# Altium schematic sheet 4_EXT_USR_LED.schdoc
size 1145 x 812 mm; Symbol: Altium_A0; Device: Altium_A0
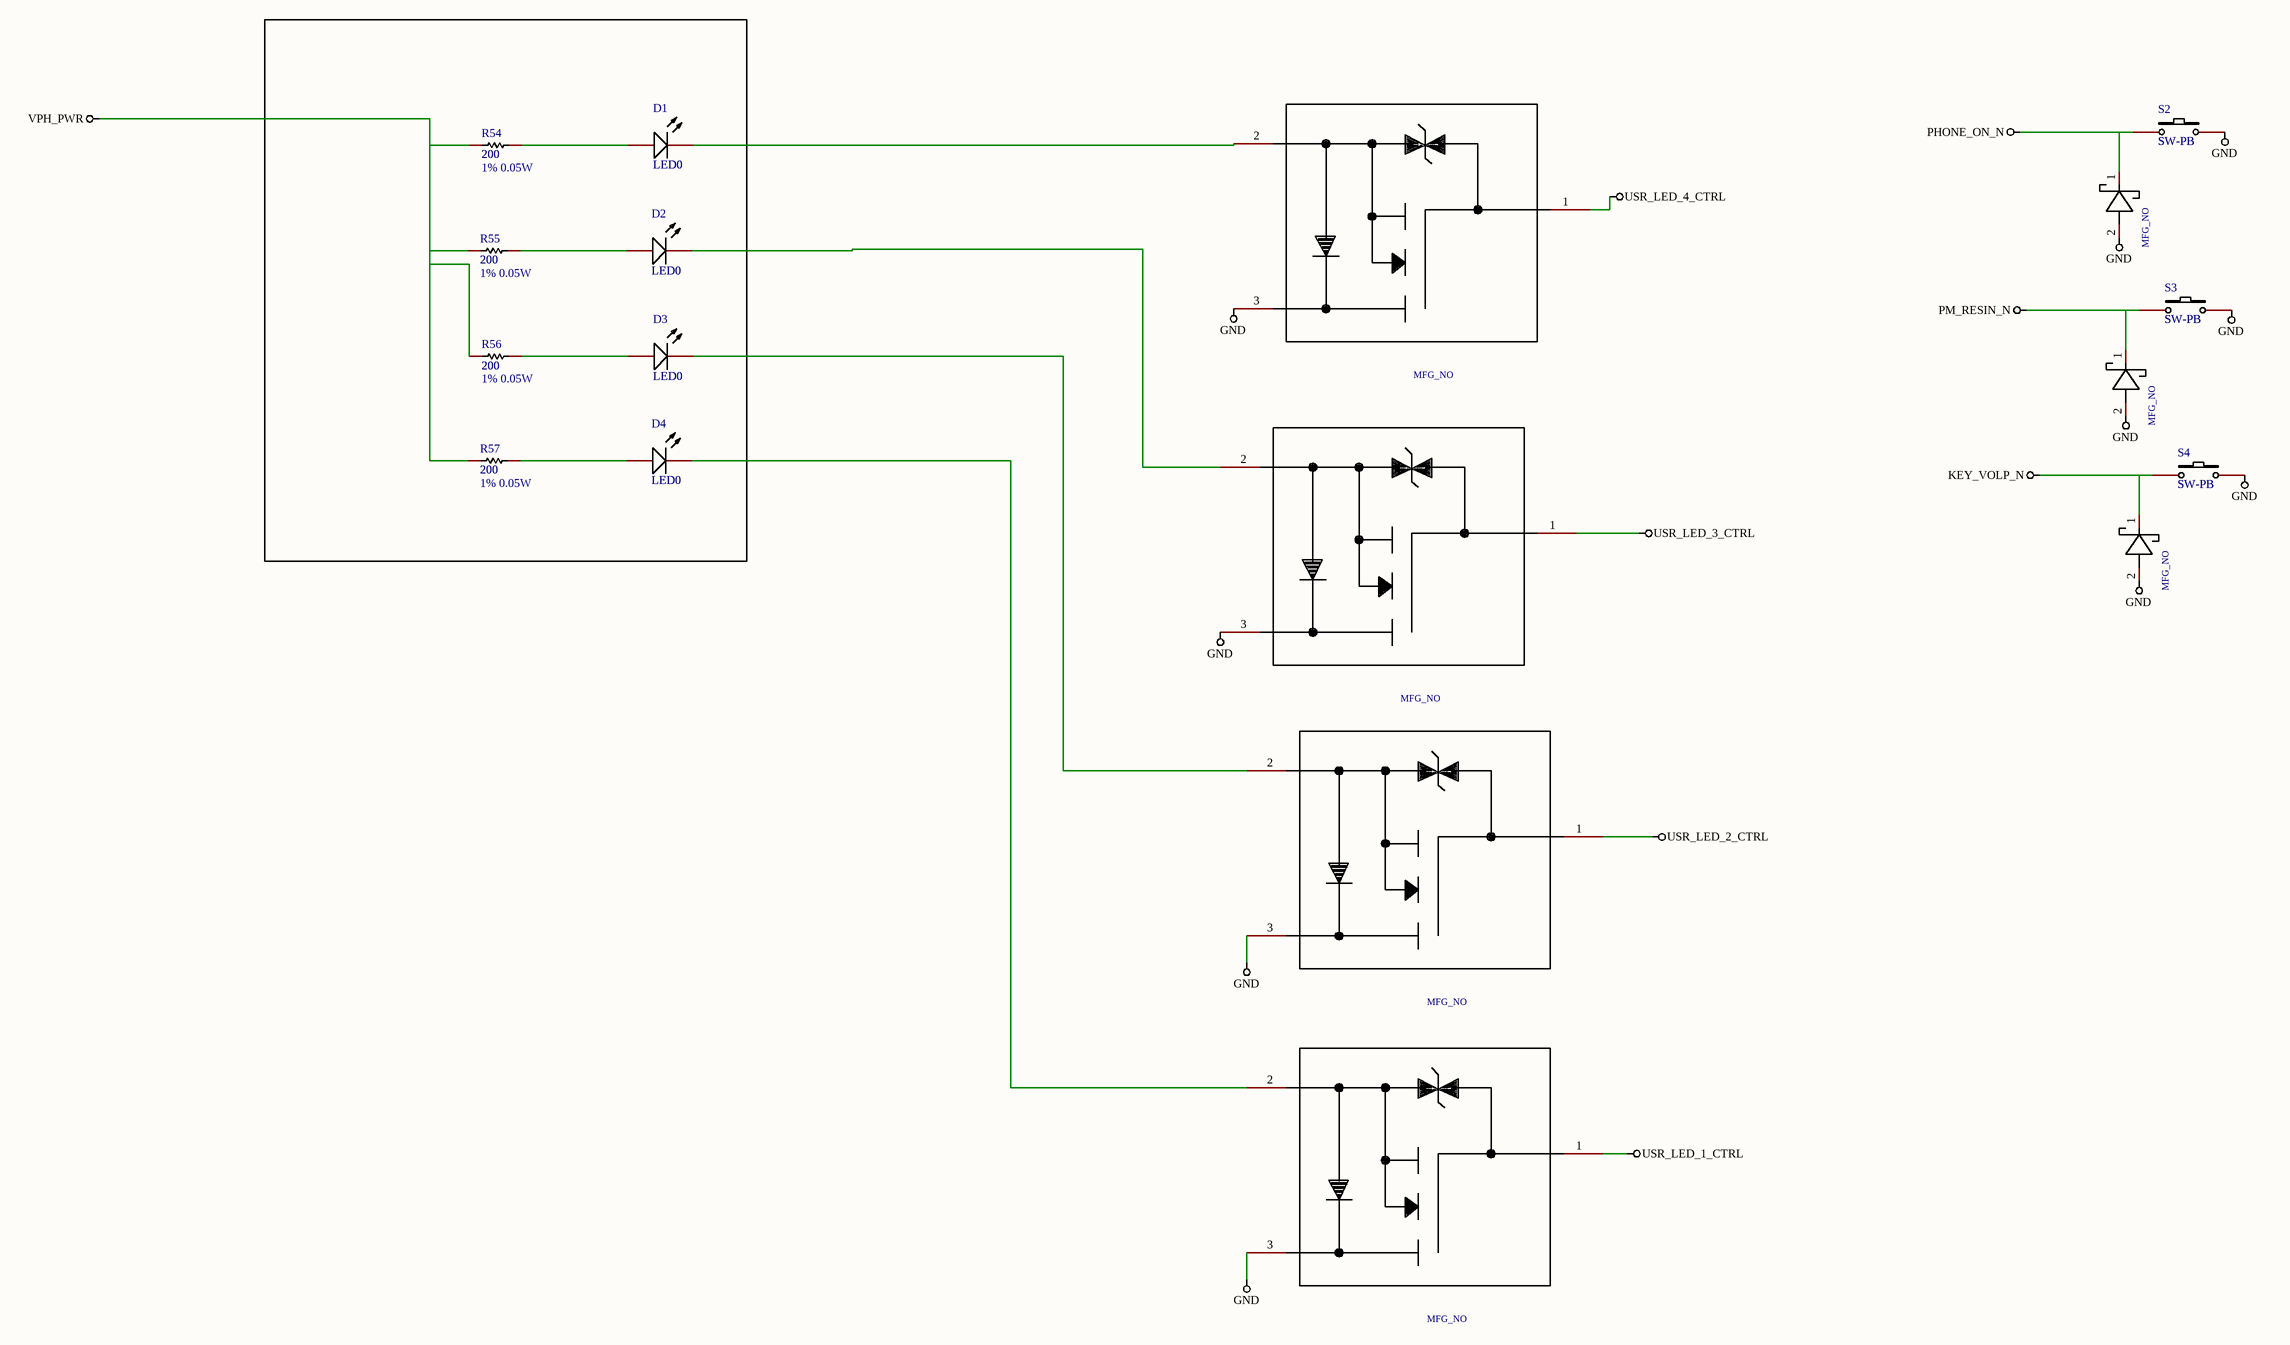
[diagram p0: 4_EXT_USR_LED.schdoc]

## Parts
CR0  PART_ID: MFG_NO  (hidden comment: SCHOTTKY)
CR1  PART_ID: MFG_NO  (hidden comment: SCHOTTKY)
CR2  PART_ID: MFG_NO  (hidden comment: SCHOTTKY)
D1  LED0
D2  LED0
D3  LED0
D4  LED0
Q2  PART_ID: MFG_NO  (hidden comment: nfet_zener_bidir)
Q3  PART_ID: MFG_NO  (hidden comment: nfet_zener_bidir)
Q4  PART_ID: MFG_NO  (hidden comment: nfet_zener_bidir)
Q5  PART_ID: MFG_NO  (hidden comment: nfet_zener_bidir)
R54  200  value 1% 0.05W
R55  200  value 1% 0.05W
R56  200  value 1% 0.05W
R57  200  value 1% 0.05W
S2  SW-PB
S3  SW-PB
S4  SW-PB

## Nets
GND: CR0.2(POS) CR1.2(POS) CR2.2(POS) Q2.3(D) Q3.3(D) Q4.3(D) Q5.3(D) S2.2 S3.2 S4.2
KEY_VOLP_N: CR2.1(NEG) S4.1
PHONE_ON_N: CR0.1(NEG) S2.1
PM_RESIN_N: CR1.1(NEG) S3.1
USR_LED_1_CTRL: Q5.1(G)
USR_LED_2_CTRL: Q4.1(G)
USR_LED_3_CTRL: Q3.1(G)
USR_LED_4_CTRL: Q2.1(G)
VPH_PWR: R54.1 R55.1 R56.1 R57.1
NetD1_1: D1.1(A) R54.2
NetD1_2: D1.2(K) Q2.2(S)
NetD2_1: D2.1(A) R55.2
NetD2_2: D2.2(K) Q3.2(S)
NetD3_1: D3.1(A) R56.2
NetD3_2: D3.2(K) Q4.2(S)
NetD4_1: D4.1(A) R57.2
NetD4_2: D4.2(K) Q5.2(S)

## Notes on the sheet
- 1
- 2
- 3
- 4
- 5
- 6
- A
- B
- C
- D
- Title
- Size
- A0
- Number
- Revision
- File:
- Date:
- Drawn By:
- Sheet
- Of

## Library data of the parts
CR0-CR2 = SCHOTTKY: PART_NUMBER: MCN_NO; OriginalSymbolOrigin: (-100,100); CDS_LMAN_SYM_OUTLINE: -50,75,50,-75; Add into BOM: yes; Name: SCHOTTKY; Symbol: SCHOTTKY; Device: SCHOTTKY; SYMNAME: SCHOTTKY; PACK_TYPE: ?; Convert to PCB: yes; Origin Footprint: SCHOTTKY; Design Item ID: SCHOTTKY; Library Name: MSM8916_DRAM_PMIC_REF_Library
D1-D4 = LED0: Typical INFRARED GaAs LED; Add into BOM: yes; Origin Footprint: LED-0; Name: LED0; Symbol: LED0; Device: LED0; Published: 8-Jun-2000; LatestRevisionDate: 08-Jul-2005; LatestRevisionNote: Mech Layer 1 removed.; PackageReference: LED-0; Publisher: Altium Limited; PackageDescription: LED; 2 Leads; Convert to PCB: yes; Design Item ID: LED0; Library Name: Miscellaneous Devices
Q2-Q5 = nfet_zener_bidir: PART_NUMBER: MCN_NO; OriginalSymbolOrigin: (-525,450); CDS_LMAN_SYM_OUTLINE: -475,450,475,-450; Add into BOM: yes; Name: nfet_zener_bidir; Symbol: NFET_ZENER_BIDIR; Device: nfet_zener_bidir; SYMNAME: nfet_zener_bidir; PACK_TYPE: ?; Convert to PCB: yes; Origin Footprint: NFET_ZENER_BIDIR; Design Item ID: NFET_ZENER_BIDIR; Library Name: MSM8916_DRAM_PMIC_REF_Library
R54-R57 = 200: Resistor; Symbol: Res1; Add into BOM: yes; Origin Footprint: AXIAL-0.3; Name: 200; Device: 200; Published: 8-Jun-2000; LatestRevisionDate: 17-Jul-2002; LatestRevisionNote: Re-released for DXP Platform.; PackageReference: AXIAL-0.3; Publisher: Altium Limited; PackageDescription: Axial Device, Thru-Hole; 2 Leads; 0.3 in Pin Spacing; Convert to PCB: yes; Design Item ID: Res1; Library Name: Miscellaneous Devices
S2-S4 = SW-PB: Switch; Add into BOM: yes; Origin Footprint: SPST-2; Name: SW-PB; Symbol: SW-PB; Device: SW-PB; Published: 24-Mar-1999; LatestRevisionDate: 17-Jul-2002; LatestRevisionNote: Re-released for DXP Platform.; PackageReference: SPST-2; Publisher: Altium Limited; PackageDescription: Switch; 2 Leads; Convert to PCB: yes; Design Item ID: SW-PB; Library Name: Miscellaneous Devices